# EAGLE design butt_blaster_mk_2 (EAGLE 6.5.0)
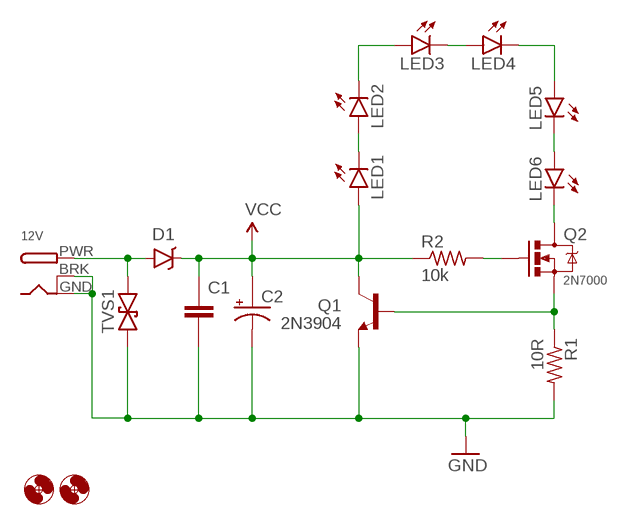
[diagram p0: schematic, sheet 1]

## Parts
12V  DCBARRELPTH  [DCJACK_2MM_PTH]
C1  CAPACITOR-CERAMIC025-024X044  [C025-024X044]
C2  CAPACITOR-POLARIZEDE2.5-6  [E2,5-6]
D1  DIODE-SCHOTTKYPTH-8.38MM  [DIODE-8.38MM]
H1  HOLE#2  [HOLE-#2]
H2  HOLE#2  [HOLE-#2]
LED1  LED5MM_SHORTPADS  [LED5MM_SHORTPADS]
LED2  LED5MM_SHORTPADS  [LED5MM_SHORTPADS]
LED3  LED5MM_SHORTPADS  [LED5MM_SHORTPADS]
LED4  LED5MM_SHORTPADS  [LED5MM_SHORTPADS]
LED5  LED5MM_SHORTPADS  [LED5MM_SHORTPADS]
LED6  LED5MM_SHORTPADS  [LED5MM_SHORTPADS]
Q1  2N3904  TRANSISTOR_NPNTO-92-AMMO-EBC  [TO-92-AMMO]
Q2  2N7000  MOSFET-NCHANNEL2N7000-AMMO  [TO-92-AMMO]
R1  10R  RESISTORPTH-AXIAL-7.68MM  [RESISTOR-AXIAL-PTH-7.68MM]
R2  10k  RESISTORPTH-AXIAL-7.68MM  [RESISTOR-AXIAL-PTH-7.68MM]
TVS1  TVSDO-41-TVS-BIDIRECTIONAL  [DO-41-TVS]

## Nets
GND: 12V.BRK 12V.GND C1.2 C2.- Q1.1(E) R1.P$2 TVS1.P$1
N$1: LED3.K(C) LED4.A
N$2: LED2.K(C) LED3.A
N$3: LED4.K(C) LED5.A
N$4: LED1.K(C) LED2.A
N$6: Q1.2(B) Q2.1(S) R1.P$1
N$7: LED6.K(C) Q2.3(D)
N$8: Q2.2(G) R2.P$2
N$10: LED5.K(C) LED6.A
N$12: 12V.PWR D1.A TVS1.P$2
VCC: C1.1 C2.+ D1.K(C) LED1.A Q1.3(C) R2.P$1

## Library data of the parts
12V = A_butts:DCBARREL: 2.0mm DC Barrel Jack DCJACK_2MM_PTH - Through Hole Jack (4UConnector: 05537)
C1 = A_butts:CAPACITOR-CERAMIC: CAPACITOR, European symbol
C2 = A_butts:CAPACITOR-POLARIZED: POLARIZED CAPACITOR, American symbol
D1 = A_butts:DIODE-SCHOTTKY: Schottky diodes in SFE's production catalog BAT20J 1A 23V 0.62Vf RB751 120mA 40V 0.37Vf PMEG4005EJ 0.5A 40V 0.42Vf MBRA140 1A 40V 0.5Vf B340A 3A 40V SMA
H1 H2 = A_butts:HOLE: MOUNTING HOLE with drill center marker
LED1-LED6 = A_butts:LED: LEDs Standard schematic elements and footprints for 5mm, 3mm, 1206, and 0603 sized LEDs. 5mm - Spark Fun Electronics SKU : COM-00529 (and others)
Q1 = A_butts:TRANSISTOR_NPN: Generic NPN BJT MMBT2222A - TRANS-08049 (SOT-23, 1A 40V) MPSA42 - TRANS-09116 (SOT-23, 500mA 300V) MMBT5088LT1G - TRANS-11160 (SOT-23, 50 mA 30V) BC547 - COM-08928 <http://www.sparkfun.com/products/8928> (TO-92 45V 100mA) (1.Collector 2.Base 3.Emitter) 2N3904 - COM-00521 <http://www.sparkfun.com/products/521> (TO-92 40V 200mA) (1.Emitter 2.Base 3.Collector) P2N2222A - COM-12852 <http://www.sparkfun.com/products/12852> (TO-92 40V 600mA) (1.Collector 2.Base 3.Emitter)
Q2 = A_butts:MOSFET-NCHANNEL: Common NMOSFET Parts MFG P/N Store ID Prod ID FDD8780 TRANS-09984 SI7820DN TRANS-11055 FDS6630A IC-08089 2N7002PW TRANS-11151 FQP30N06L COM-10213 TRANS-10060 BSS123LT1G TRANS-08345 BSS138 TRANS-00830 BS170 2N7000
R1 R2 = A_butts:RESISTOR: RESISTOR, American symbol
TVS1 = A_butts:TVS: Transient voltage suppressor- prevents ESD on inputs. Ignore package description- MBRA140 is NOT this type of part!!!

## Board
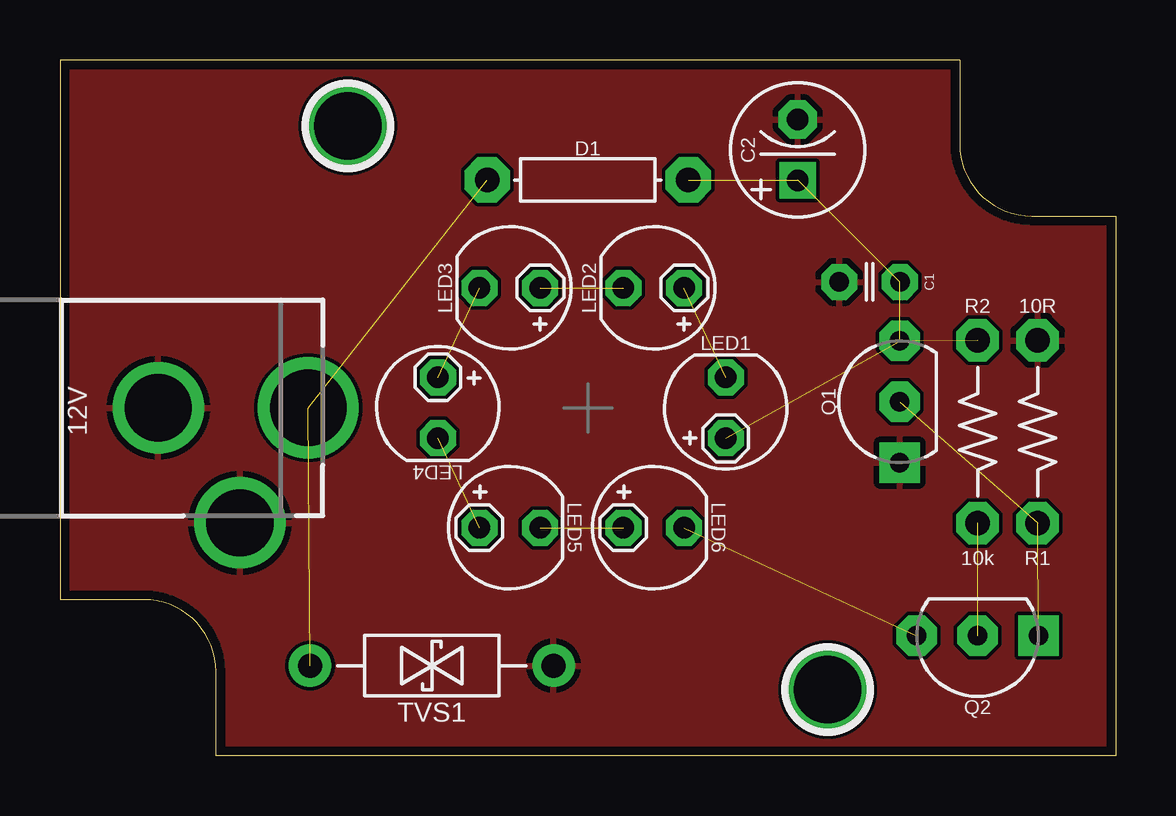
[diagram p1: board, top side]
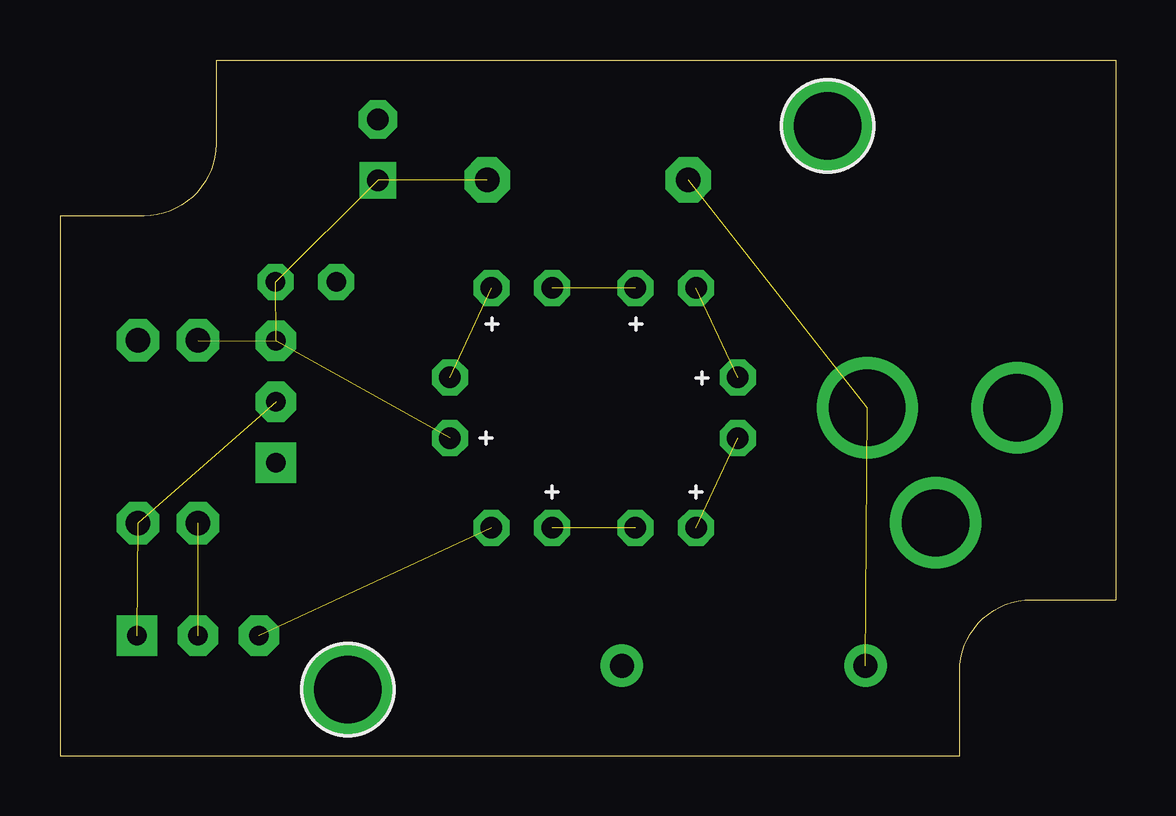
[diagram p2: board, bottom side, seen from below]

Size 44 x 29 mm. Coordinates in mm from the lower left corner, seen from the top.
Outline: 44,22.5 44,0 6.5,0 6.5,3.5 arc90 3.5,6.5 0,6.5 0,29 37.5,29 37.5,25.5 arc90 40.5,22.5 44,22.5
Copper layers (1*16): Top 0.0356mm / dielectric 1.5011mm / Bottom 0.0356mm
Design rules "LaenPCBOrder_2": minimum track width 6mil, minimum drill 13mil, track to track 6mil, track to pad 6mil, pad to pad 6mil, via to via 6mil, smd to smd 6mil, copper to edge 15mil, drill to drill 6mil, minimum pad ring 7mil, minimum via ring 7mil, stop-mask expansion 3mil, vias tented up to drill 20mil, thermal gap 10mil

### Footprints (pad centres in the part's own frame; a part is rotated, then mirrored left to right if it is on the bottom)
DCJACK_2MM_PTH = drill 2.8: BRK 4.8,10.75; GND 0,7.35 | drill 3.2: PWR 0,13.6
C025-024X044 = drill 0.813 pad 1.5 octagon: 1 -1.27,0; 2 1.27,0
E2,5-6 = drill 0.9 pad 1.524 square: + -1.27,0 | drill 0.9 pad 1.6 octagon: - 1.27,0
DIODE-8.38MM = drill 1.016 pad 1.905 octagon: A -4.191,0; K 4.191,0
HOLE-#2 = drill 2.8 pad 3.81: P$1 0,0
LED5MM_SHORTPADS = drill 0.9 pad 1.5 octagon: A -1.27,0; K 1.27,0
TO-92-AMMO = drill 0.813 pad 1.676 square: 1 -2.54,0 | drill 0.813 pad 1.676 octagon: 2 0,0; 3 2.54,0
RESISTOR-AXIAL-PTH-7.68MM = drill 1.016 pad 1.778 octagon: P$1 -3.81,0; P$2 3.81,0
DO-41-TVS = drill 1 pad 1.778: P$1 -5.08,0; P$2 5.08,0

### Placement (x,y rotation side)
12V  -3.25,14.5 270 top
C1  33.75,19.75 180 top
C2  30.75,25.25 90 top
D1  22,24 0 top
H1  12,26.25 0 top
H2  32,2.75 0 top
LED1  27.75,14.5 90 top
LED2  24.75,19.5 180 top
LED3  18.75,19.5 180 top
LED4  15.75,14.5 270 top
LED5  18.75,9.5 0 top
LED6  24.75,9.5 0 top
Q1  35,14.75 90 top
Q2  38.25,5 180 top
R1  40.75,13.5 90 top
R2  38.25,13.5 270 top
TVS1  15.5,3.75 180 top

### Tracks (layer width: path | path; a pad name or v marks a point on that pad's centre or on a via)
GND
  pour Top: 0,0 0,29 44,29 44,0
N$1  (1 unrouted)
N$2  (1 unrouted)
N$3  (1 unrouted)
N$4  (1 unrouted)
N$6  (2 unrouted)
N$7  (1 unrouted)
N$8  (1 unrouted)
N$10  (1 unrouted)
N$12  (2 unrouted)
VCC  (5 unrouted)